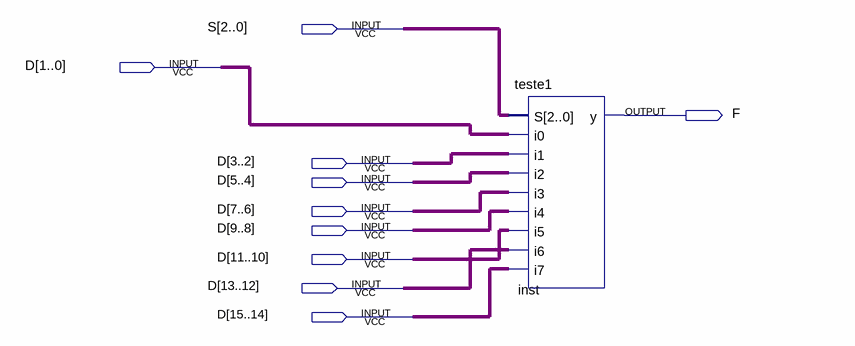
[diagram p0: schematic sheet]
// Quartus schematic teste3.bdf as structural Verilog: 1 symbols, 10 pins
module teste3 (
  input  [2:0] S,
  input  [15:0] D,
  output F
);

  teste1 inst (
    .S(S), .i0(D[1:0]), .i1(D[3:2]), .i2(D[5:4]), .i3(D[7:6]), .i4(D[9:8]), .i5(D[11:10]), .i6(D[13:12]),
    .i7(D[15:14]), .y(F));
endmodule
